# Altium schematic sheet Programming.SchDoc
size C
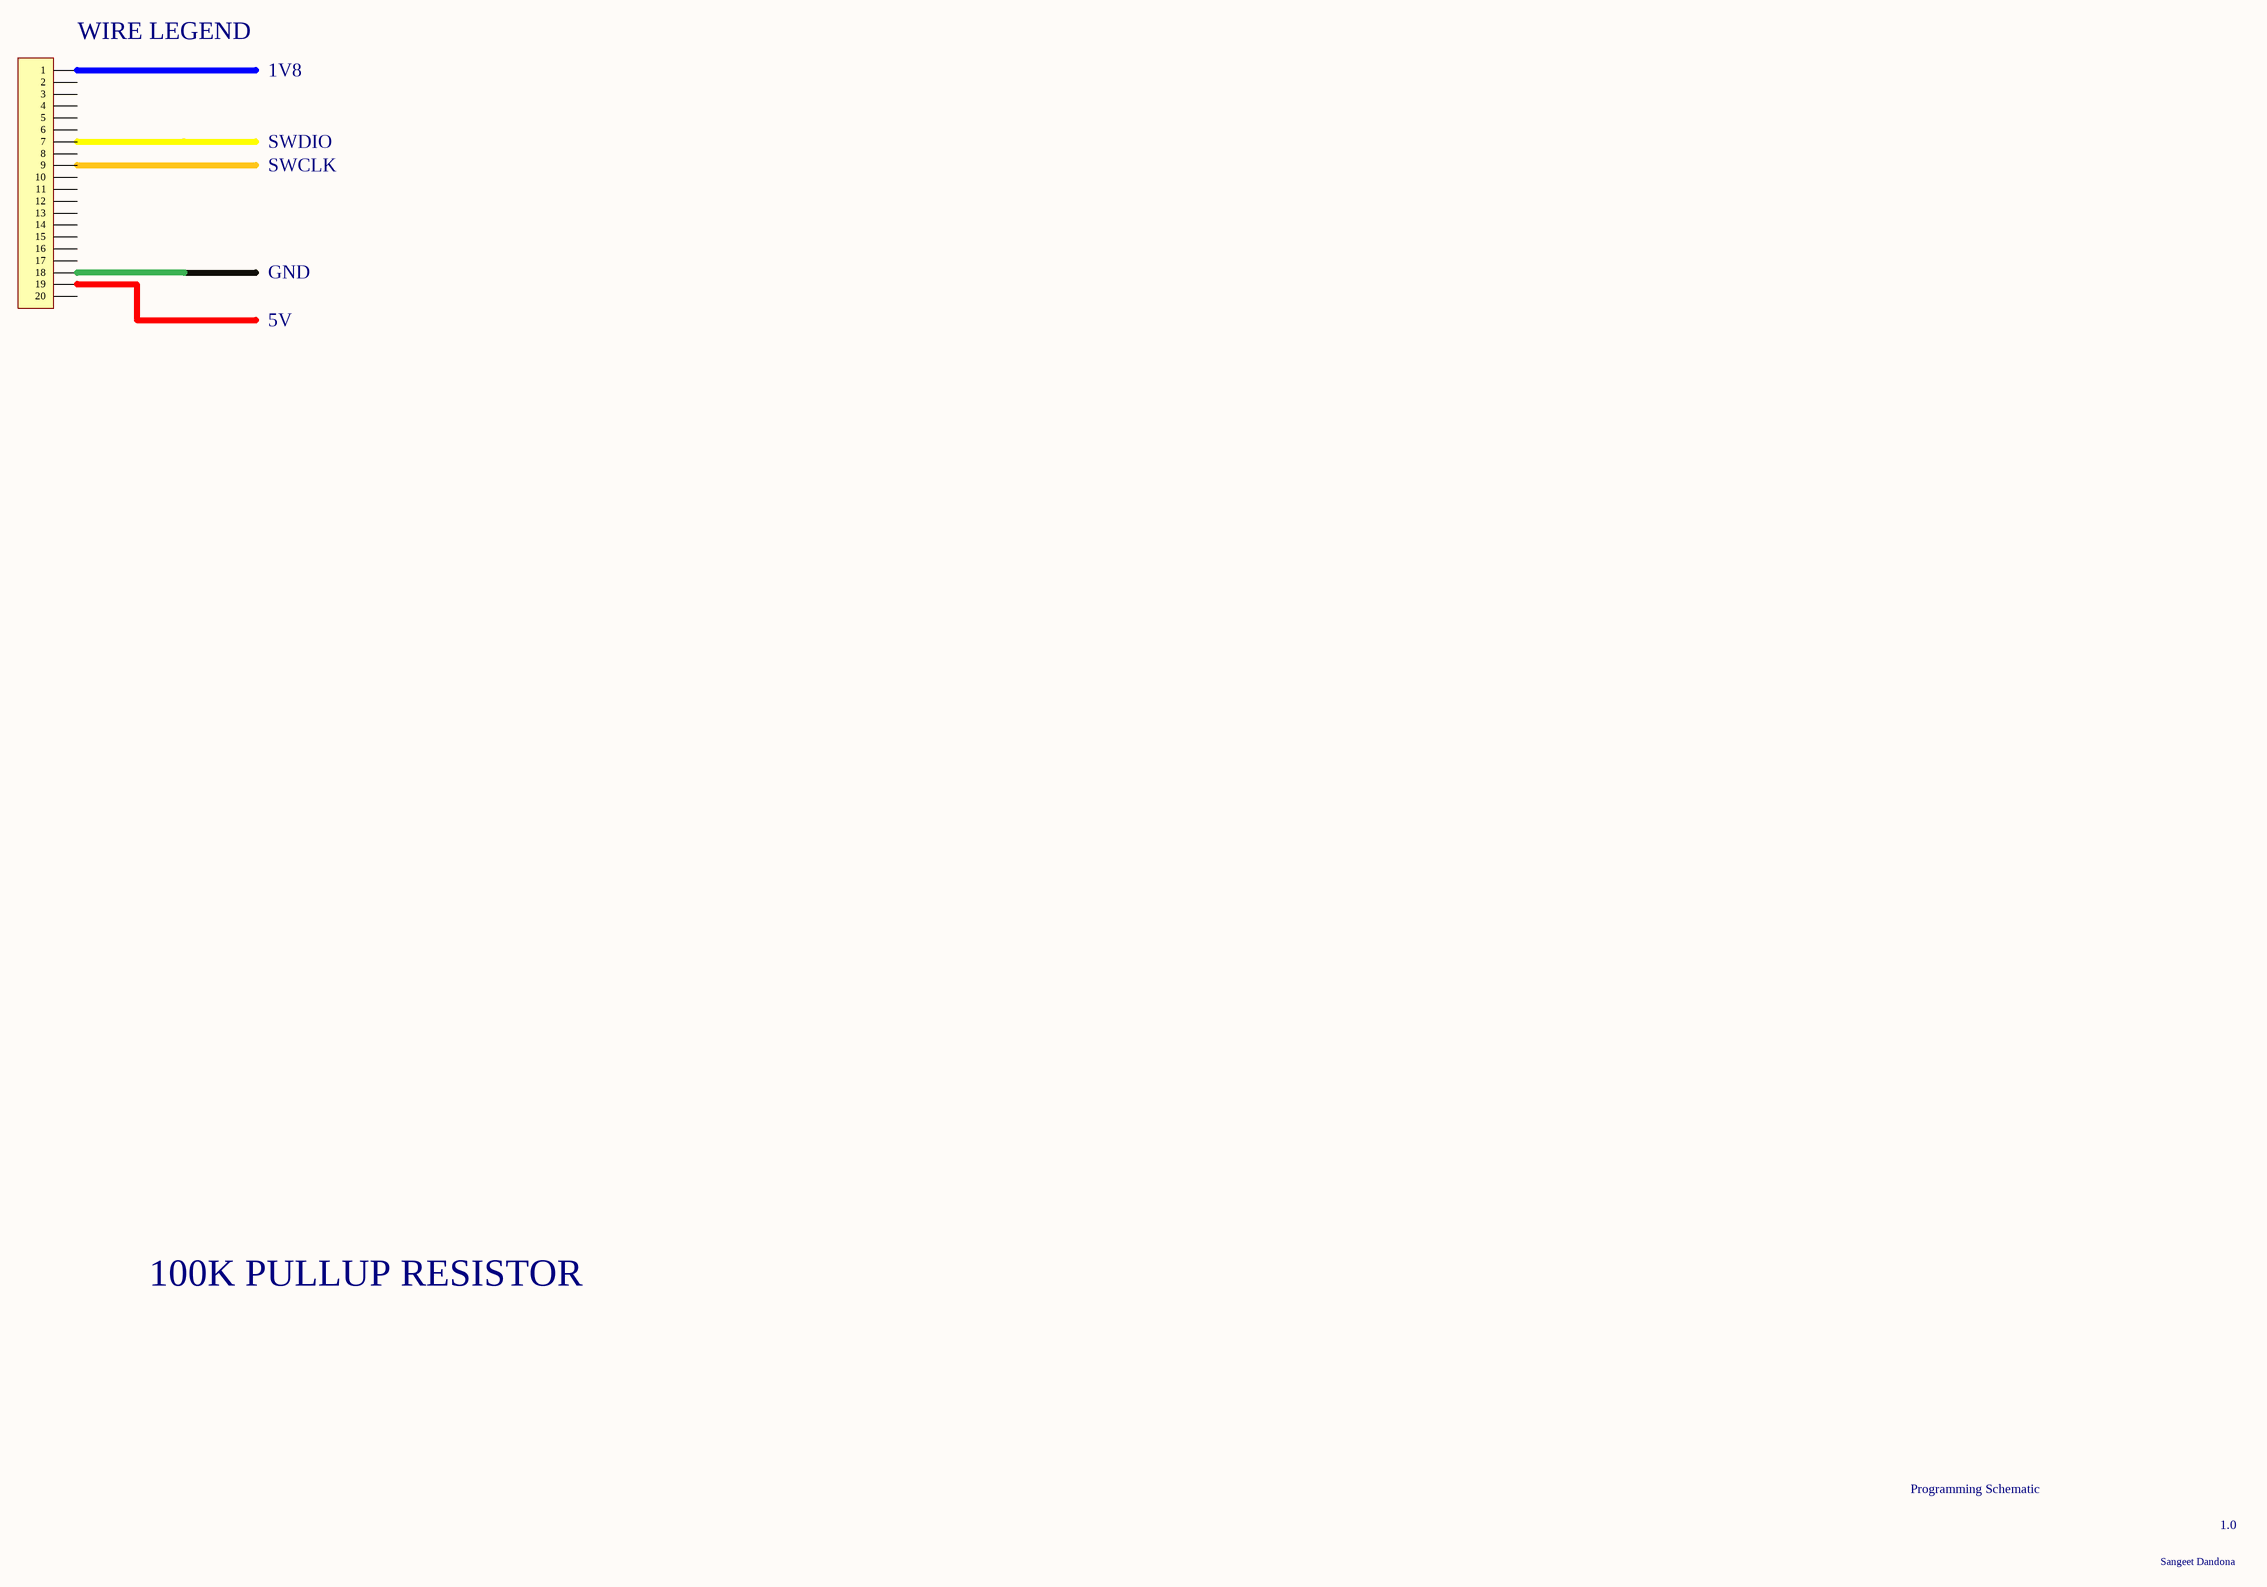
[diagram p0: Programming.SchDoc]

## Parts
P?  Header 20  [HDR1X20]  (value not drawn)

## Nets

Not connected (* = marked no-connect by the designer): P? 1 2 3 4 5 6 7 8 9 10 11 12 13 14 15 16 17 18 19 20

## Notes on the sheet
- (near P?) WIRE LEGEND
- 1V8
- SWDIO
- SWCLK
- GND
- 5V
- 100K PULLUP RESISTOR
- Programming Schematic
- Sangeet Dandona
- 1.0

## Library data of the parts
P? = Header 20: Header, 20-Pin; LatestRevisionDate: 17-Jul-2002; LatestRevisionNote: Re-released for DXP Platform.; Publisher: Altium Limited